# EAGLE schematic RemoteBoard (EAGLE 9.4.2)
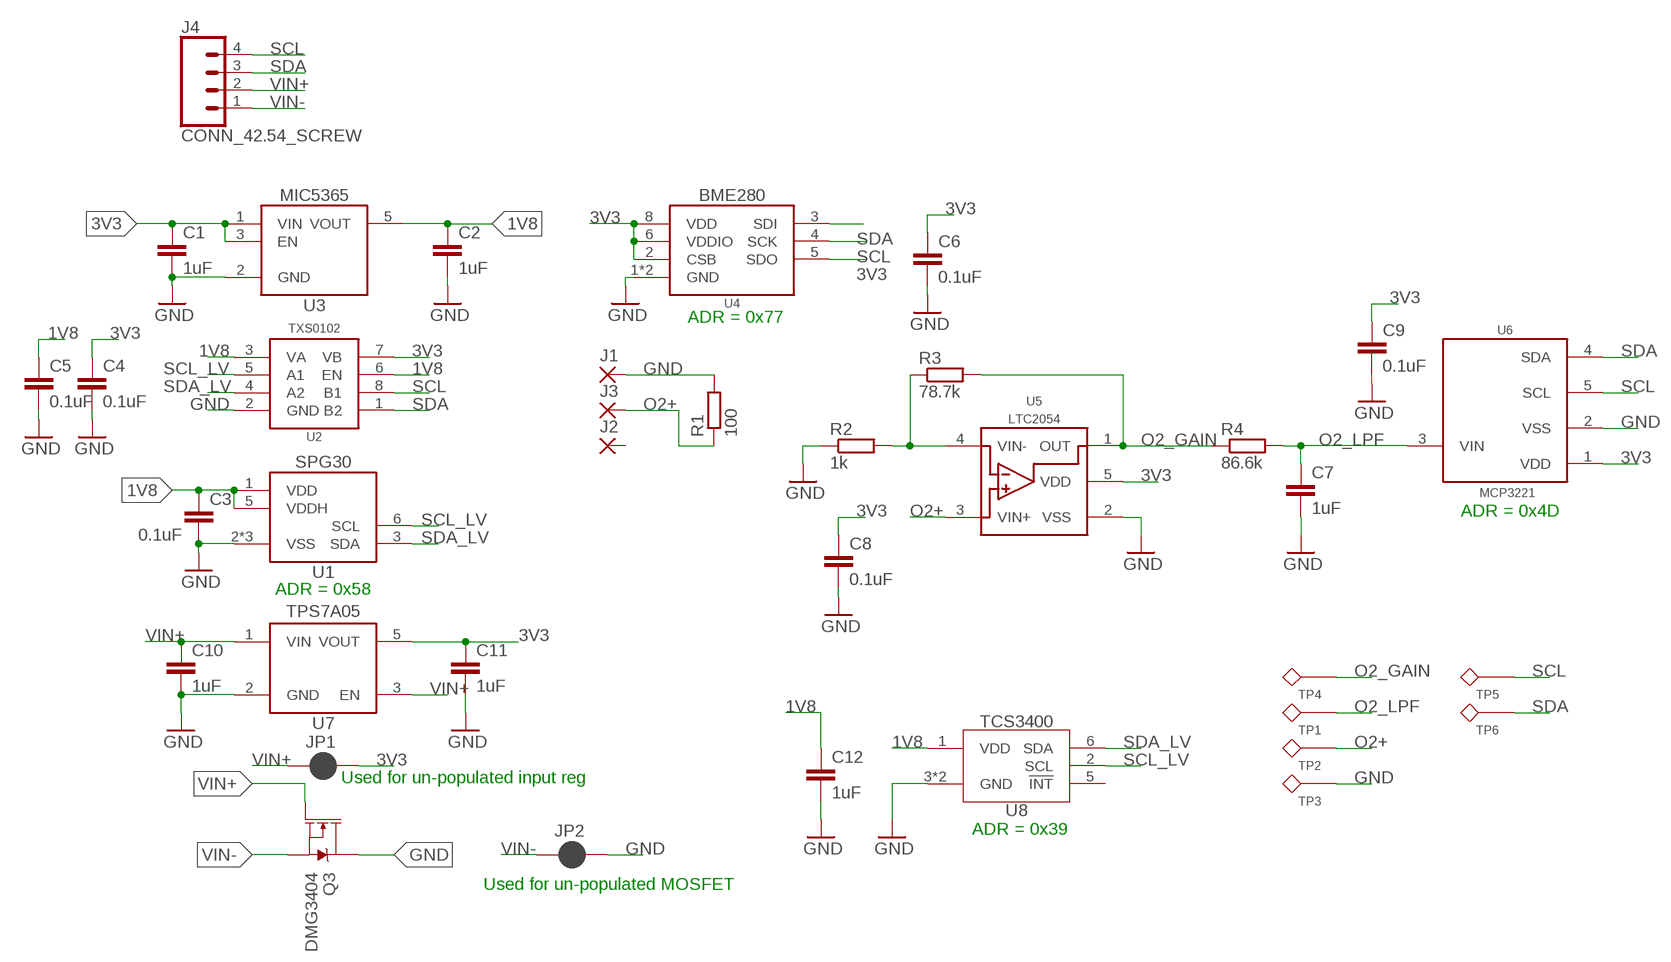
[diagram p0: schematic, sheet 1]

## Parts
C1  1uF  C-EU1UFC0805  [C0805]
C2  1uF  C-EU1UFC0805  [C0805]
C3  0.1uF  C-EU0.1UFC0805  [C0805]
C4  0.1uF  C-EU0.1UFC0805  [C0805]
C5  0.1uF  C-EU0.1UFC0805  [C0805]
C6  0.1uF  C-EU0.1UFC0805  [C0805]
C7  1uF  C-EU1UFC0805  [C0805]
C8  0.1uF  C-EU0.1UFC0805  [C0805]
C9  0.1uF  C-EU0.1UFC0805  [C0805]
C10  1uF  C-EU1UFC0805  [C0805]
C11  1uF  C-EU1UFC0805  [C0805]
C12  1uF  C-EU1UFC0805  [C0805]
J1  SOCKETS9111_SLOT  [SOCKET_S9111-45R_SLOT]
J2  SOCKETS9111_SLOT  [SOCKET_S9111-45R_SLOT]
J3  SOCKETS9111_SLOT  [SOCKET_S9111-45R_SLOT]
J4  CONN_42.54_SCREW  [1X04_SCREW]
JP1  JUMPER-SMT_2_NC_PASTE_SILK  [SMT-JUMPER_2_NC_PASTE_SILK]
JP2  JUMPER-SMT_2_NC_PASTE_SILK  [SMT-JUMPER_2_NC_PASTE_SILK]
Q3  DMG3404  MOSFET-NCH-DMG3404L  [SOT23-3]
R1  100  R-EU_100R0805  [R0805]
R2  1k  R-EU_1KR0805  [R0805]
R3  78.7k  R-EU_78.7KR0805  [R0805]
R4  86.6k  R-EU_86.6KR0805  [R0805]
TP1  TESTPOINTRCU  [TESTPOINT_0603]
TP2  TESTPOINTRCU  [TESTPOINT_0603]
TP3  TESTPOINTRCU  [TESTPOINT_0603]
TP4  TESTPOINTRCU  [TESTPOINT_0603]
TP5  TESTPOINTRCU  [TESTPOINT_0603]
TP6  TESTPOINTRCU  [TESTPOINT_0603]
U1  SPG30  [DFN_6_2.5X2.5]
U2  TXS0102DCU  [DCU_(R-PDSO-G8)]
U3  MIC53651.8SC70  [DCK_R-PDSO-G5]
U4  BME280  [BME280]
U5  LTC2054  [SOT23-5]
U6  MCP3221  [SOT23-5]
U7  TPS7A0533DBV  [SOT23-5]
U8  TCS3400  [TCS3400]

## Nets
1V8: C2.1 C3.1 C5.1 C12.1 U1.1(VDD) U1.5(VDDH) U2.3(VA) U2.6(EN) U3.5(VOUT) U8.1(VDD)
3V3: C1.1 C4.1 C6.1 C8.1 C9.1 C11.1 JP1.2 U2.7(VB) U3.1(VIN) U3.3(EN) U4.2(CSB) U4.5(SDO) U4.6(VDDIO) U4.8(VDD) U5.5(VDD) U6.1(VDD) U7.5(VOUT)
GND: C1.2 C2.2 C3.2 C4.2 C5.2 C6.2 C7.2 C8.2 C9.2 C10.2 C11.2 C12.2 J1.PAD(P) JP2.2 Q3.3(D) R1.2 R2.1 TP3.1 U1.2(VSS) U1.4(VSS) U1.EP(VSS) U2.2(GND) U3.2(GND) U4.1(GND) U4.7(GND) U5.2(VSS) U6.2(VSS) U7.2(GND) U8.3(GND) U8.4(GND)
N$1: R2.2 R3.1 U5.4(VIN-)
O2+: J3.PAD(P) R1.1 TP2.1 U5.3(VIN+)
O2_GAIN: R3.2 R4.1 TP4.1 U5.1(OUT)
O2_LPF: C7.1 R4.2 TP1.1 U6.3(VIN)
SCL: J4.4 TP5.1 U2.8(B1) U4.4(SCK) U6.5(SCL)
SCL_LV: U1.6(SCL) U2.5(A1) U8.2(SCL)
SDA: J4.3 TP6.1 U2.1(B2) U4.3(SDI) U6.4(SDA)
SDA_LV: U1.3(SDA) U2.4(A2) U8.6(SDA)
VIN+: C10.1 J4.2 JP1.1 Q3.1(G) U7.1(VIN) U7.3(EN)
VIN-: J4.1 JP2.1 Q3.2(S)
Unconnected: J2.PAD(P) U8.5(!INT)

## Notes on the sheet
- ADR = 0x77
- ADR = 0x4D
- ADR = 0x58
- Used for un-populated input reg
- ADR = 0x39
- Used for un-populated MOSFET

## Library data of the parts
C1 C2 C7 C10-C12 = bschulz_passives:C-EU: CAPACITOR, European symbol; DIGIKEY: 311-1456-1-ND; MF: Yageo; MPN: CC0805KKX7R8BB105
C3-C6 C8 C9 = bschulz_passives:C-EU: CAPACITOR, European symbol; DIGIKEY: 399-8000-1-ND; MF: Kemet; MPN: C0805C104M3RACTU
J1-J3 = bschulz:SOCKET: Generic Board Socket; DIGIKEY: 952-3660-1-ND; MF: Harwin; MPN: S9111-45R
J4 = bschulz:CONN_4: Genaric 4 terminal header Digikey 2.54_SCREW <https://www.digikey.com/product-detail/en/on-shore-technology-inc/OSTVN04A150/ED10563-ND/1588864>; DIGIKEY: ED10563-ND; MF: On Shore; MPN: OSTVN04A150
JP1 JP2 = SparkFun-Jumpers:JUMPER-SMT_2_NC_PASTE: Normally closed solder jumper This jumper has an aperture in the stencil to allow solder paste to bridge the split in the wire so it's normally closed (NC). Wick off the solder to open the connection. Reapply solder to reclose the connection.
Q3 = bschulz:MOSFET-NCH: N-channel MOSFETs Voltage controlled devices that allow control of high current outputs. SparkFun Products: SparkFun OpenScale <https://www.sparkfun.com/products/13261> SparkFun Digital Sandbox <https://www.sparkfun.com/products/12651> SparkFun Monster Moto Shield <https://www.sparkfun.com/products/10182> SparkFun MOSFET Power Controller <https://www.sparkfun.com/products/11214>; DIGIKEY: DMG3404L-7DICT-ND; MF: Diodes Incorporated; MPN: DMG3404L-7
R1 = bschulz_passives:R-EU_: RESISTOR, European symbol Digikey Parts: Yageo, 0402 <https://www.digikey.com/products/en/resistors/chip-resistor-surface-mount/52?k=&pkeyword=&sf=0&FV=ffec1104%2Cfffc000d%2C1c0002%2C440067%2C1f140000%2Cffe00034%2C400004&quantity=&ColumnSort=0&page=1&stock=1&pageSize=25> Yageo, 0603 <https://www.digikey.com/products/en/resistors/chip-resistor-surface-mount/52?k=&pkeyword=&s=4356&s=47360&sf=0&FV=fffc000d%2C1c0002%2C142c040c%2C1f140000%2Cffe00034&quantity=10&ColumnSort=1000011&page=1&stock=1&pageSize=25> Panasonic, 0603 <https://www.digikey.com/products/en/resistors/chip-resistor-surface-mount/52?k=&pkeyword=&pv252=68&sf=0&FV=ffec373d%2C1c0002%2C142c040c%2C1f140000%2Cffe00034%2C80002%2Cc0001&quantity=&ColumnSort=0&page=1&stock=1&pageSize=25> Panasonic, precision, 0603 <https://www.digikey.com/products/en/resistors/chip-resistor-surface-mount/52?FV=ffec4907%2Cfffc000a%2Cc0172%2C142c040c%2C1f140000%2Cffe00034%2C1c0002&quantity=100&ColumnSort=2085&page=1&stock=1&pageSize=25> Panasonic, 0805 <https://www.digikey.com/products/en/resistors/chip-resistor-surface-mount/52?k=&pkeyword=&pv3=1&sf=0&FV=ffec373d%2C1c0002%2C1f140000%2Cffe00034%2C142c040d&quantity=&ColumnSort=0&page=1&stock=1&pageSize=25> Rohm, current sense <https://www.digikey.com/products/en/resistors/chip-resistor-surface-mount/52?k=&pkeyword=&pv3=1&sf=0&FV=ffecb688%2C1f140000%2Cffe00034%2C1c0002&quantity=&ColumnSort=0&page=1&stock=1&pageSize=25> Vishay, pulse proof automotive <https://www.digikey.com/products/en/resistors/chip-resistor-surface-mount/52?k=&pkeyword=&pv7=2&sf=0&FV=ffec5d6b%2Cffe00034%2C1f140000&quantity=&ColumnSort=0&page=1&stock=1&pageSize=25>; DIGIKEY: 311-100CRCT-ND; MF: Yageo; MPN: RC0805FR-07100RL
R2 = bschulz_passives:R-EU_: RESISTOR, European symbol Digikey Parts: Yageo, 0402 <https://www.digikey.com/products/en/resistors/chip-resistor-surface-mount/52?k=&pkeyword=&sf=0&FV=ffec1104%2Cfffc000d%2C1c0002%2C440067%2C1f140000%2Cffe00034%2C400004&quantity=&ColumnSort=0&page=1&stock=1&pageSize=25> Yageo, 0603 <https://www.digikey.com/products/en/resistors/chip-resistor-surface-mount/52?k=&pkeyword=&s=4356&s=47360&sf=0&FV=fffc000d%2C1c0002%2C142c040c%2C1f140000%2Cffe00034&quantity=10&ColumnSort=1000011&page=1&stock=1&pageSize=25> Panasonic, 0603 <https://www.digikey.com/products/en/resistors/chip-resistor-surface-mount/52?k=&pkeyword=&pv252=68&sf=0&FV=ffec373d%2C1c0002%2C142c040c%2C1f140000%2Cffe00034%2C80002%2Cc0001&quantity=&ColumnSort=0&page=1&stock=1&pageSize=25> Panasonic, precision, 0603 <https://www.digikey.com/products/en/resistors/chip-resistor-surface-mount/52?FV=ffec4907%2Cfffc000a%2Cc0172%2C142c040c%2C1f140000%2Cffe00034%2C1c0002&quantity=100&ColumnSort=2085&page=1&stock=1&pageSize=25> Panasonic, 0805 <https://www.digikey.com/products/en/resistors/chip-resistor-surface-mount/52?k=&pkeyword=&pv3=1&sf=0&FV=ffec373d%2C1c0002%2C1f140000%2Cffe00034%2C142c040d&quantity=&ColumnSort=0&page=1&stock=1&pageSize=25> Rohm, current sense <https://www.digikey.com/products/en/resistors/chip-resistor-surface-mount/52?k=&pkeyword=&pv3=1&sf=0&FV=ffecb688%2C1f140000%2Cffe00034%2C1c0002&quantity=&ColumnSort=0&page=1&stock=1&pageSize=25> Vishay, pulse proof automotive <https://www.digikey.com/products/en/resistors/chip-resistor-surface-mount/52?k=&pkeyword=&pv7=2&sf=0&FV=ffec5d6b%2Cffe00034%2C1f140000&quantity=&ColumnSort=0&page=1&stock=1&pageSize=25>; DIGIKEY: 311-1.00KCRCT-ND; MF: Yageo; MPN: RC0805FR-071KL
R3 = bschulz_passives:R-EU_: RESISTOR, European symbol Digikey Parts: Yageo, 0402 <https://www.digikey.com/products/en/resistors/chip-resistor-surface-mount/52?k=&pkeyword=&sf=0&FV=ffec1104%2Cfffc000d%2C1c0002%2C440067%2C1f140000%2Cffe00034%2C400004&quantity=&ColumnSort=0&page=1&stock=1&pageSize=25> Yageo, 0603 <https://www.digikey.com/products/en/resistors/chip-resistor-surface-mount/52?k=&pkeyword=&s=4356&s=47360&sf=0&FV=fffc000d%2C1c0002%2C142c040c%2C1f140000%2Cffe00034&quantity=10&ColumnSort=1000011&page=1&stock=1&pageSize=25> Panasonic, 0603 <https://www.digikey.com/products/en/resistors/chip-resistor-surface-mount/52?k=&pkeyword=&pv252=68&sf=0&FV=ffec373d%2C1c0002%2C142c040c%2C1f140000%2Cffe00034%2C80002%2Cc0001&quantity=&ColumnSort=0&page=1&stock=1&pageSize=25> Panasonic, precision, 0603 <https://www.digikey.com/products/en/resistors/chip-resistor-surface-mount/52?FV=ffec4907%2Cfffc000a%2Cc0172%2C142c040c%2C1f140000%2Cffe00034%2C1c0002&quantity=100&ColumnSort=2085&page=1&stock=1&pageSize=25> Panasonic, 0805 <https://www.digikey.com/products/en/resistors/chip-resistor-surface-mount/52?k=&pkeyword=&pv3=1&sf=0&FV=ffec373d%2C1c0002%2C1f140000%2Cffe00034%2C142c040d&quantity=&ColumnSort=0&page=1&stock=1&pageSize=25> Rohm, current sense <https://www.digikey.com/products/en/resistors/chip-resistor-surface-mount/52?k=&pkeyword=&pv3=1&sf=0&FV=ffecb688%2C1f140000%2Cffe00034%2C1c0002&quantity=&ColumnSort=0&page=1&stock=1&pageSize=25> Vishay, pulse proof automotive <https://www.digikey.com/products/en/resistors/chip-resistor-surface-mount/52?k=&pkeyword=&pv7=2&sf=0&FV=ffec5d6b%2Cffe00034%2C1f140000&quantity=&ColumnSort=0&page=1&stock=1&pageSize=25>; DIGIKEY: 311-78.7KCRCT-ND; MF: Yageo; MPN: RC0805FR-0778K7L
R4 = bschulz_passives:R-EU_: RESISTOR, European symbol Digikey Parts: Yageo, 0402 <https://www.digikey.com/products/en/resistors/chip-resistor-surface-mount/52?k=&pkeyword=&sf=0&FV=ffec1104%2Cfffc000d%2C1c0002%2C440067%2C1f140000%2Cffe00034%2C400004&quantity=&ColumnSort=0&page=1&stock=1&pageSize=25> Yageo, 0603 <https://www.digikey.com/products/en/resistors/chip-resistor-surface-mount/52?k=&pkeyword=&s=4356&s=47360&sf=0&FV=fffc000d%2C1c0002%2C142c040c%2C1f140000%2Cffe00034&quantity=10&ColumnSort=1000011&page=1&stock=1&pageSize=25> Panasonic, 0603 <https://www.digikey.com/products/en/resistors/chip-resistor-surface-mount/52?k=&pkeyword=&pv252=68&sf=0&FV=ffec373d%2C1c0002%2C142c040c%2C1f140000%2Cffe00034%2C80002%2Cc0001&quantity=&ColumnSort=0&page=1&stock=1&pageSize=25> Panasonic, precision, 0603 <https://www.digikey.com/products/en/resistors/chip-resistor-surface-mount/52?FV=ffec4907%2Cfffc000a%2Cc0172%2C142c040c%2C1f140000%2Cffe00034%2C1c0002&quantity=100&ColumnSort=2085&page=1&stock=1&pageSize=25> Panasonic, 0805 <https://www.digikey.com/products/en/resistors/chip-resistor-surface-mount/52?k=&pkeyword=&pv3=1&sf=0&FV=ffec373d%2C1c0002%2C1f140000%2Cffe00034%2C142c040d&quantity=&ColumnSort=0&page=1&stock=1&pageSize=25> Rohm, current sense <https://www.digikey.com/products/en/resistors/chip-resistor-surface-mount/52?k=&pkeyword=&pv3=1&sf=0&FV=ffecb688%2C1f140000%2Cffe00034%2C1c0002&quantity=&ColumnSort=0&page=1&stock=1&pageSize=25> Vishay, pulse proof automotive <https://www.digikey.com/products/en/resistors/chip-resistor-surface-mount/52?k=&pkeyword=&pv7=2&sf=0&FV=ffec5d6b%2Cffe00034%2C1f140000&quantity=&ColumnSort=0&page=1&stock=1&pageSize=25>; DIGIKEY: 311-86.6KCRCT-ND; MF: Yageo; MPN: RC0805FR-0786K6L
TP1-TP6 = bschulz:TESTPOINT; DIGIKEY: A106145CT-ND; MF: TE Connectivity; MPN: RCU-0C
U1 = bschulz:SPG30: SGP30 - Multi-pixel Gas Sensor (TVOC, CO2EQ) Characteristics: Vcc: 1.8V Gas Sensing: Ethanol, H2, TVOC, CO2eq Sample Rate: 1Hz (Air Quality), 40Hz (Gas) Operating Temperature: -40°C to 85°C Digikey: 1649-1084-1-ND <https://www.digikey.com/product-detail/en/sensirion-ag/SGP30-2.5K/1649-1084-1-ND/7400967>; DIGIKEY: 1649-1084-1-ND; MF: Sensirion; MPN: SGP30-2.5K
U2 = bschulz:TXS0102: TXS0102 - 2 Channel Bidirectional Voltage Level Translator Characteristics: Vcc: 1.65 ~ 3.6V (Port A), 2.3 ~ 5.5V (Port B) IQ: 14.4μA Output Current: 50mA Output Type: Open Drain/Push-Pull Operating Temperature: -40°C to 85°C Digikey: 296-28368-1-ND (DQE) <https://www.digikey.com/product-detail/en/texas-instruments/TXS0102DQER/296-28368-1-ND/2625893> 296-28435-1-ND (DQM) <https://www.digikey.com/product-detail/en/texas-instruments/TXS0102DQMR/296-28435-1-ND/2638910> 296-21931-1-ND (DCU) <https://www.digikey.com/product-detail/en/texas-instruments/TXS0102DCUR/296-21931-1-ND/1629284>; DIGIKEY: 296-21931-1-ND; MF: TI; MPN: TXS0102DCUR
U3 = bschulz:MIC5365: MIC5365-* - Low Power, High Performance, Linear Regulator Characteristics: Vin: 2.5V ~ 5.5V Vout: Many options, (1v ~ 3.3v) see datasheet <http://ww1.microchip.com/downloads/en/DeviceDoc/mic5365.pdf> IQ: 29μA typ Dropout Voltage: 55mV @ 50mA, input ≥ 2.8v Voltage Accuracy: 2% typ Output Current: 150 mA Operating Temperature: -40°C to 125°C Mouser: MIC5365-3.3YC5 (3.3V Fixed) <https://www.digikey.com/product-detail/en/microchip-technology/MIC5365-3.3YC5-TR/576-3193-1-ND/1868230> MIC5365-1.8YC5 (1.8V Fixed) <https://www.digikey.com/products/en/integrated-circuits-ics/pmic-voltage-regulators-linear/699?k=mic5365&k=&pkeyword=mic5365&sv=0&pv1291=881&sf=0&FV=1c0002%2C1f140000%2Cffe002bb%2C1bcc0020&quantity=&ColumnSort=0&page=1&stock=1&pageSize=25>; DIGIKEY: 576-3181-1-ND; MF: Microchip; MPN: MIC5365-1.8YC5-TR
U4 = bschulz:BME280: BME280 - Combined Digital Humidity and Pressure Sensor Characteristics: Vcc: 1.8V ~ 3.3V Pressure Range: 300 ~ 1100 mBar Pressure Resolution: 0.0015 mBar, max Pressure Accuracy: relative ±0.12 mBar, abs ± 1 mBar Humidity Resolution: 0.008% RH, max Humidity Accuracy: ±3% RH Temperature Resolution: 0.01°C Temperature Accuracy: 0.5°C Operating Temperature: -40°C to 85°C Digikey: 828-1063-1-ND <https://www.digikey.com/product-detail/en/bosch-sensortec/BME280/828-1063-1-ND/6136314>; DIGIKEY: 828-1063-1-ND; DISP: BME280; MF: Bosch; MPN: BME280
U5 = bschulz:LTC2054: LTC2054 -Single Micropower Zero Drift Op-Amp Characteristics: Vs: 2.7 ~ 6V (2.7 ~ +/- 5.5V for LTC2054HV) Iq: 175uA GBP: 500kHz PSSR: 130dB CMMR: 130dB Operating Temperature: -40°C to 85°C Digikey: LTC2054CS5#TRPBFCT-ND <https://www.digikey.com/scripts/DkSearch/dksus.dll?Detail&itemSeq=258611552&uq=636603257096973101> LTC2054HVIS5#TRMPBFCT-ND (High Voltage Variant) <https://www.digikey.com/product-detail/en/linear-technology-analog-devices/LTC2054HVIS5-TRMPBF/LTC2054HVIS5-TRMPBFCT-ND/3830416>; DIGIKEY: LTC2054HS5#TRMPBFCT-ND; DISP: LTC2054; MF: LT; MPN: LTC2054HS5#TRMPBF
U6 = bschulz:MCP3221: MCP342* - SAR ADC Characteristics: VCC: 2.7~5.5V Operating Temperature: -40°C to 125°C Number of Inputs: 1 Sample Rate: 22.3k Samples Per Second Number of Bits: 12 Digikey: MCP3221A5T-I/OTCT-ND <https://www.digikey.com/product-detail/en/microchip-technology/MCP3221A5T-I-OT/MCP3221A5T-I-OTCT-ND/529836>; DIGIKEY: MCP3221A5T-I/OTCT-ND; DISP: MCP3221; MF: TI; MPN: MCP3221A5T-I/OT
U7 = bschulz:TPS7A05*: TPS7A05* - Ultra Low Power Low Dropout Linear Regulator Characteristics: Vin: 1.4V ~ 5.5V Vout: 0.8, 1.0, 1.2, 1.5, 1.8, 2.5, 2.85, 3.3V fixed IQ: 1μA typ, 3μA max Voltage Accuracy: 1% typ, 3% max Output Current: 200 mA Operating Temperature: -40°C to 125°C Mouser: TPS7A0533 (3.3V Fixed) <https://www.mouser.com/ProductDetail/Texas-Instruments/TPS7A0533PDBVR?qs=sGAEpiMZZMsGz1a6aV8DcD1rpA6FsR3J1Mp5DdTpiXw%3d> TPS7A0518 (1.8V Fixed) <https://www.mouser.com/ProductDetail/Texas-Instruments/TPS7A0518PDBVR?qs=sGAEpiMZZMsGz1a6aV8DcD1rpA6FsR3J1f7DNYacdSI%3d>; DIGIKEY: 296-50256-1-ND; MF: TI; MOUSER: 595-TPS7A0533PDBVR; MPN: TPS7A0533PDBVR
U8 = bschulz:TCS3400: TCS3400 - Ambient Multi-Band Light Sensor with I2C Interface Characteristics: VCC: 2.7~3.6V VIO: Vcc (TCS34001/5), 1.8V (TCS34003/7) Operating Temperature: -40°C to 70°C Digikey: TCS34003FNMCT-ND <https://www.digikey.com/products/en/sensors-transducers/optical-sensors-ambient-light-ir-uv-sensors/536?k=tcs3400&k=&pkeyword=tcs3400&sv=0&pv7=2&sf=0&FV=-8%7C536%2C1989%7C0&quantity=&ColumnSort=0&page=1&stock=1&pageSize=25>; DIGIKEY: TCS34003FNMCT-ND; MF: AMS; MPN: TCS34003FNM